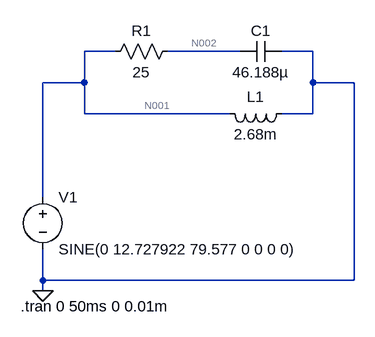
[diagram p0: schematic scheme9.asc]
scheme9.asc, the LTspice schematic file:
Version 4
SHEET 1 880 680
WIRE 400 -48 352 -48
WIRE 592 -48 480 -48
WIRE 704 -48 656 -48
WIRE 352 0 352 -48
WIRE 352 0 288 0
WIRE 704 0 704 -48
WIRE 768 0 704 0
WIRE 352 48 352 0
WIRE 576 48 352 48
WIRE 704 48 704 0
WIRE 704 48 656 48
WIRE 288 176 288 0
WIRE 288 304 288 256
WIRE 768 304 768 0
WIRE 768 304 288 304
WIRE 288 320 288 304
FLAG 288 320 0
SYMBOL voltage 288 160 R0
WINDOW 123 0 0 Left 0
WINDOW 39 0 0 Left 0
SYMATTR InstName V1
SYMATTR Value SINE(0 12.727922 79.577 0 0 0 0)
SYMBOL ind 672 32 R90
WINDOW 0 5 56 VBottom 2
WINDOW 3 32 56 VTop 2
SYMATTR InstName L1
SYMATTR Value 2.68m
SYMBOL res 496 -64 R90
WINDOW 0 0 56 VBottom 2
WINDOW 3 32 56 VTop 2
SYMATTR InstName R1
SYMATTR Value 25
SYMBOL cap 656 -64 R90
WINDOW 0 0 32 VBottom 2
WINDOW 3 32 32 VTop 2
SYMATTR InstName C1
SYMATTR Value 46.188µ
TEXT 254 344 Left 2 !.tran 0 50ms 0 0.01m

The netlist it stands for:
* scheme9.asc
V1 N001 0 SINE(0 12.727922 79.577 0 0 0 0)
L1 0 N001 2.68m
R1 N002 N001 25
C1 0 N002 46.188µ
.tran 0 50ms 0 0.01m
.backanno
.end

* Results of the author's LTspice run, read from the files saved beside the schematic
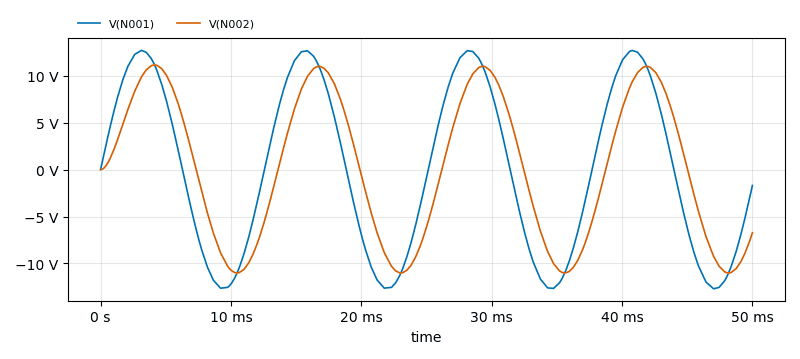
[diagram p1: Transient Analysis of scheme9.asc, plotted from the saved traces]
* Transient Analysis, 1 run:
*   V(N001): min -12.71 V, max 12.73 V, average 4.977 mV, rms 9.008 V, last -1.686 V
*   V(N002): min -11.02 V, max 11.17 V, average 159.6 mV, rms 7.822 V, last -6.728 V